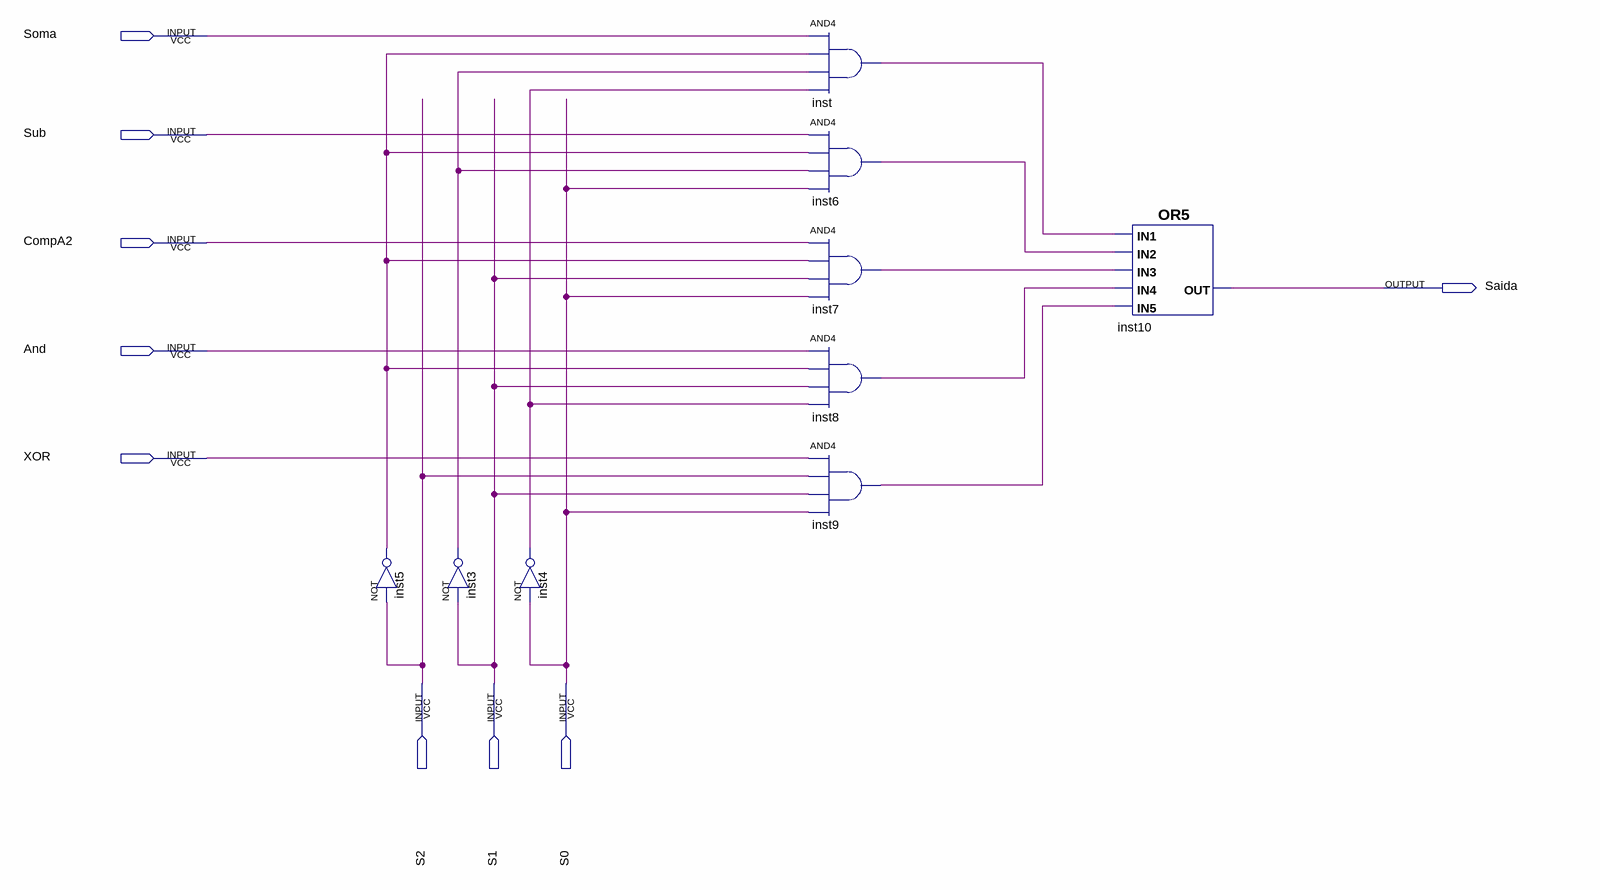
[diagram p0: schematic sheet]
// Quartus schematic Mux5to1.bdf as structural Verilog: 9 symbols, 9 pins
module Mux5to1 (
  input  Soma,
  input  Sub,
  input  CompA2,
  input  And,
  input  XOR,
  input  S2,
  input  S1,
  input  S0,
  output Saida
);

  wire inst3_out, inst4_out, inst5_out, inst6_out, inst7_out, inst8_out, inst9_out, inst_out;

  not inst5 (inst5_out, S2);
  not inst3 (inst3_out, S1);
  not inst4 (inst4_out, S0);
  and inst (inst_out, Soma, inst5_out, inst3_out, inst4_out);
  and inst6 (inst6_out, Sub, inst5_out, inst3_out, S0);
  and inst7 (inst7_out, CompA2, inst5_out, S1, S0);
  and inst8 (inst8_out, And, inst5_out, S1, inst4_out);
  and inst9 (inst9_out, XOR, S2, S1, S0);
  or inst10 (Saida, inst_out, inst6_out, inst7_out, inst8_out, inst9_out);
endmodule
